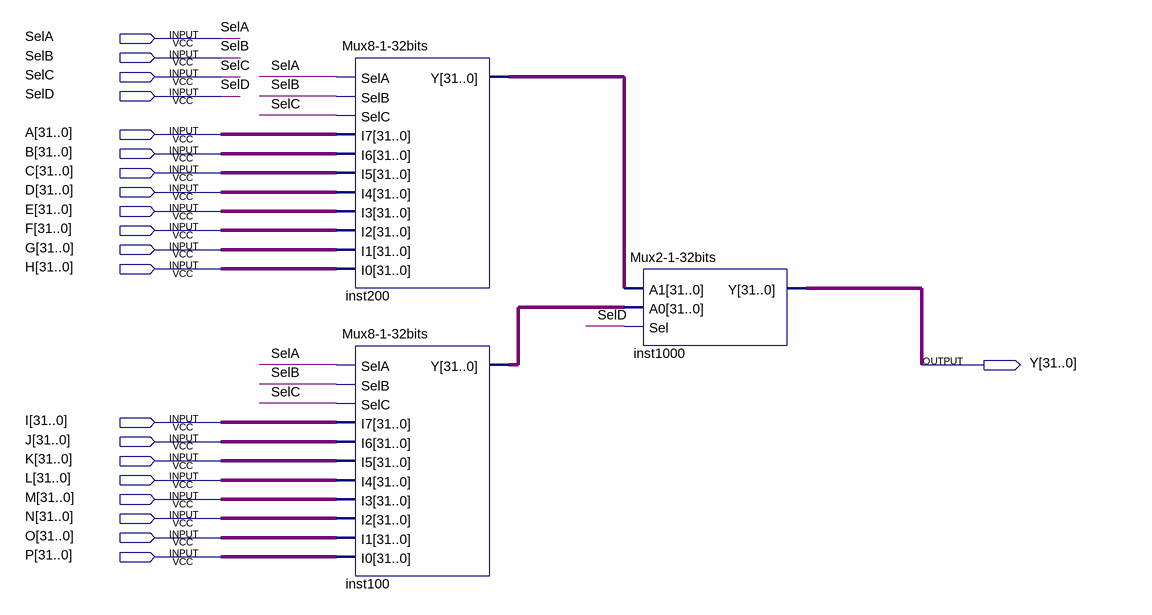
[diagram p0: schematic sheet]
// Quartus schematic Mux32-1-32bits.bdf as structural Verilog: 3 symbols, 21 pins
module \Mux32-1-32bits  (
  input  SelA,
  input  SelB,
  input  SelC,
  input  SelD,
  input  [31:0] A,
  input  [31:0] B,
  input  [31:0] C,
  input  [31:0] D,
  input  [31:0] E,
  input  [31:0] F,
  input  [31:0] G,
  input  [31:0] H,
  input  [31:0] I,
  input  [31:0] J,
  input  [31:0] K,
  input  [31:0] L,
  input  [31:0] M,
  input  [31:0] N,
  input  [31:0] O,
  input  [31:0] P,
  output [31:0] Y
);

  wire [31:0] inst100_y, inst200_y;

  \Mux8-1-32bits  inst200 (
    .SelA(SelA), .SelB(SelB), .SelC(SelC), .I7(A), .I6(B), .I5(C), .I4(D), .I3(E), .I2(F), .I1(G), .I0(H),
    .Y(inst200_y));
  \Mux8-1-32bits  inst100 (
    .SelA(SelA), .SelB(SelB), .SelC(SelC), .I7(I), .I6(J), .I5(K), .I4(L), .I3(M), .I2(N), .I1(O), .I0(P),
    .Y(inst100_y));
  \Mux2-1-32bits  inst1000 (.A1(inst200_y), .A0(inst100_y), .Sel(SelD), .Y(Y));
endmodule
